# EasyEDA schematic SCH_MuteMe-Arduino_2022-08-23.json
TITLE: Sheet_1; REV: 1.0; Date: 2022-08-21; Sheet: 1/1; Drawn By: Spencer Owen; Company: Your Company
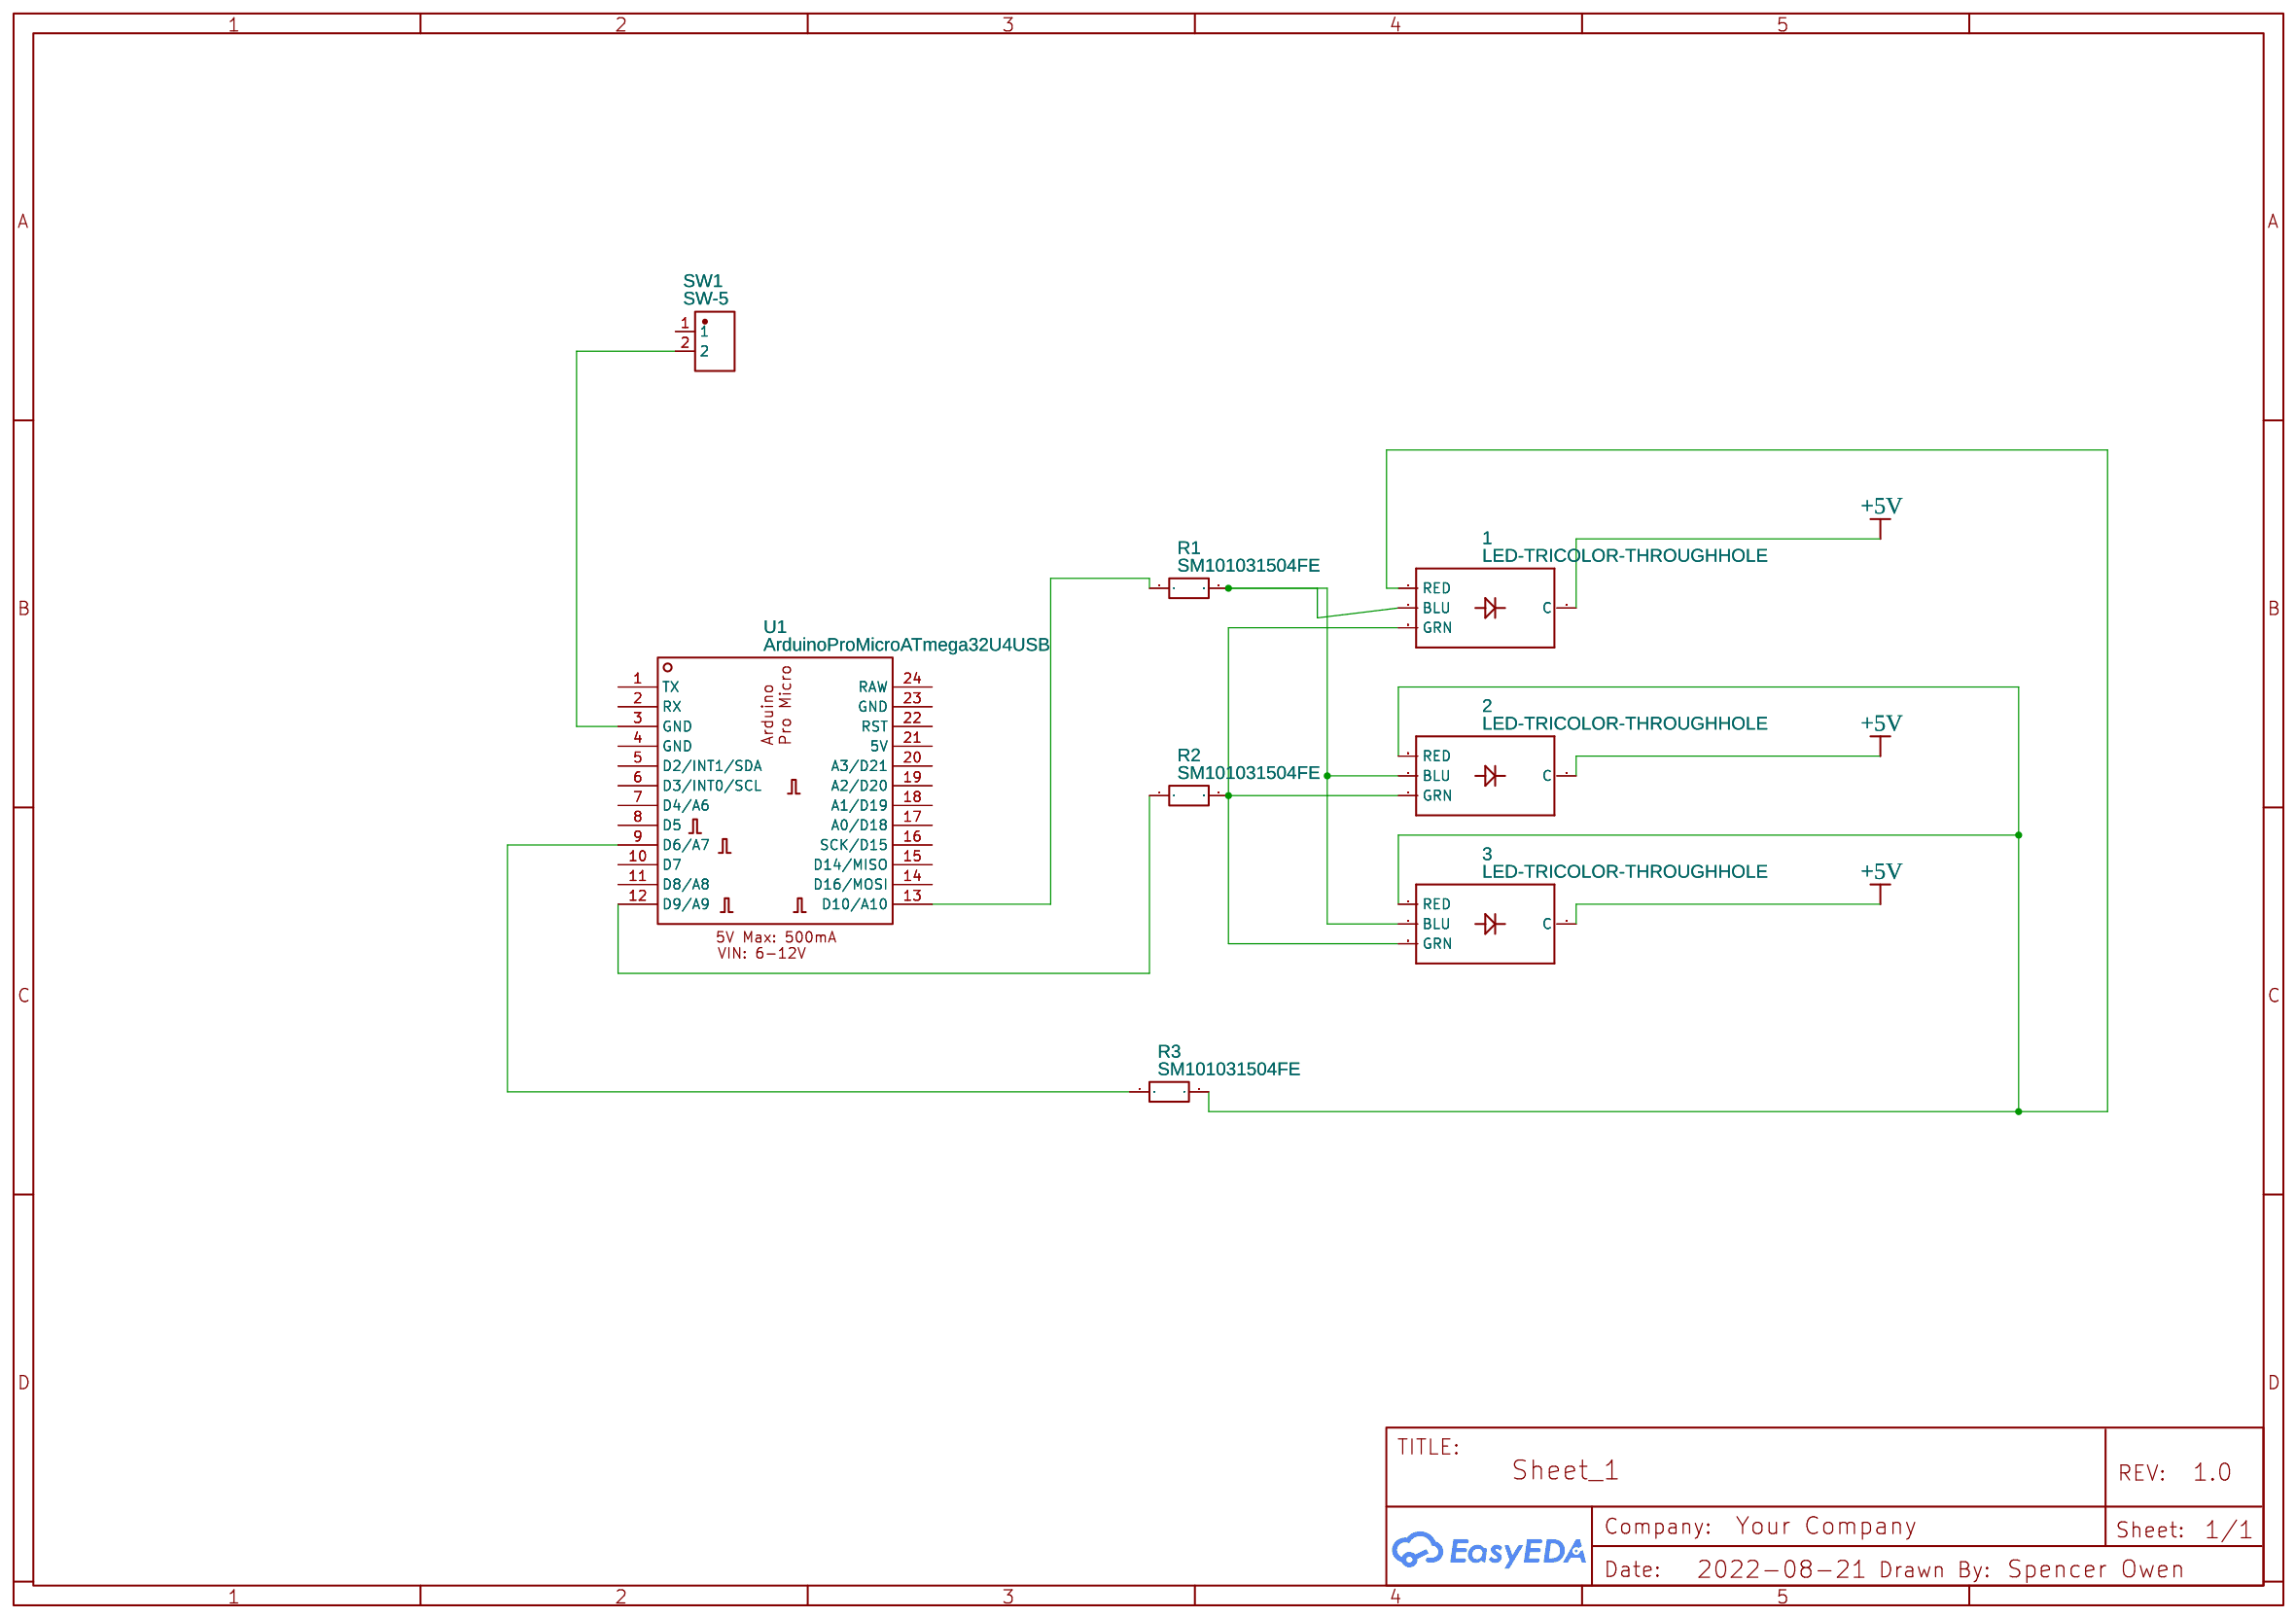
[diagram p0: schematic sheet]

## Parts
1  LED-TRICOLOR-THROUGHHOLE  [LED-TRICOLOR-THROUGHHOLE]
2  LED-TRICOLOR-THROUGHHOLE  [LED-TRICOLOR-THROUGHHOLE]
3  LED-TRICOLOR-THROUGHHOLE  [LED-TRICOLOR-THROUGHHOLE]
R1  SM101031504FE  [RES-TH_L6.4-W1.8-P5.08-D0.6]
R2  SM101031504FE  [RES-TH_L6.4-W1.8-P5.08-D0.6]
R3  SM101031504FE  [RES-TH_L6.4-W1.8-P5.08-D0.6]
SW1  SW-5  [SW-SMD_KAILH-SOCKET_C9900019772]
U1  ArduinoProMicroATmega32U4USB  [ARDUINOPROMICROUSB]

## Library data of the parts
1-3 = LED-TRICOLOR-THROUGHHOLE: Contributor: vaclav_benes
R1-R3 = SM101031504FE: Supplier: LCSC; Supplier Part: C3577345; Manufacturer: Ohmite; link: https://atta.szlcsc.comnull; Contributor: lcsc
SW1 = SW-5: Supplier: LCSC; Supplier Part: C9900019772; Manufacturer: null; JLCPCB Part Class: Extended Part; Contributor: lcsc
U1 = ArduinoProMicroATmega32U4USB: Contributor: laurent.mas

## Nets
+5V: 1.GND(C) 2.GND(C) 3.GND(C)
Net-(1-BLU): 1.BLU 2.BLU 3.BLU R1.2
Net-(1-GRN): 1.GRN 2.GRN 3.GRN R2.2
Net-(1-RED): 1.RED 2.RED 3.RED R3.2
Net-(R1-1): R1.1 U1.13(D10/A10)
Net-(R2-1): R2.1 U1.12(D9/A9)
Net-(R3-1): R3.1 U1.9(D6/A7)
Net-(SW1-2): SW1.2 U1.3(GND)

Not connected (* = marked no-connect by the designer): SW1 1; U1 1(TX) 2(RX) 4(GND) 5(D2/INT1/SDA) 6(D3/INT0/SCL) 7(D4/A6) 8(D5) 10(D7) 11(D8/A8) 14(D16/MOSI) 15(D14/MISO) 16(SCK/D15) 17(A0/D18) 18(A1/D19) 19(A2/D20) 20(A3/D21) 21(5V) 22(RST) 23(GND) 24(RAW)
